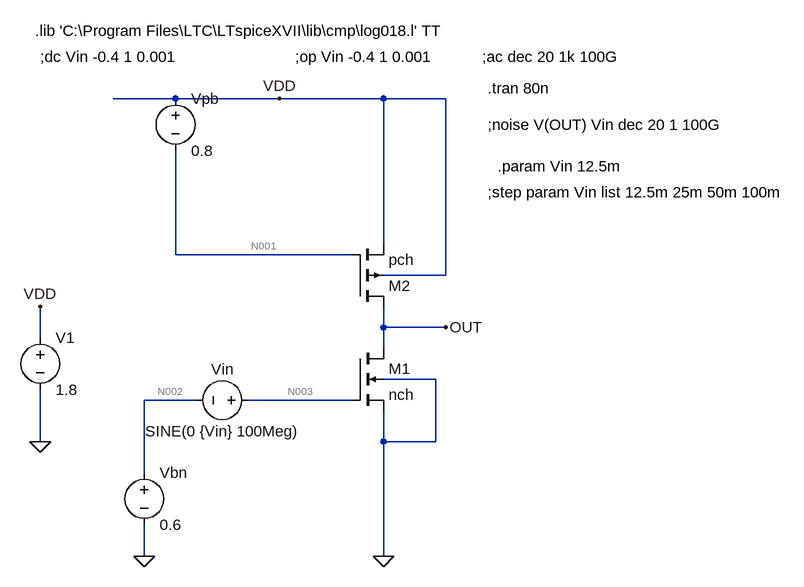
[diagram p0: schematic Draft1.asc]
Draft1.asc, the LTspice schematic file:
Version 4
SHEET 1 1212 884
WIRE 240 160 144 160
WIRE 400 160 240 160
WIRE 560 160 400 160
WIRE 656 160 560 160
WIRE 560 384 560 160
WIRE 240 400 240 240
WIRE 512 400 240 400
WIRE 656 432 656 160
WIRE 656 432 560 432
WIRE 560 512 560 480
WIRE 656 512 560 512
WIRE 32 528 32 480
WIRE 560 544 560 512
WIRE 640 592 560 592
WIRE 272 624 192 624
WIRE 512 624 352 624
WIRE 32 688 32 608
WIRE 560 688 560 640
WIRE 640 688 640 592
WIRE 640 688 560 688
WIRE 192 736 192 624
WIRE 192 864 192 816
WIRE 560 864 560 688
FLAG 32 688 0
FLAG 32 480 VDD
FLAG 192 864 0
FLAG 560 864 0
FLAG 656 512 OUT
FLAG 400 160 VDD
DATAFLAG 560 512 ""
SYMBOL nmos4 512 544 R0
SYMATTR InstName M1
SYMATTR Value nch
SYMATTR Value2 l=180n w=10u m=2
SYMBOL pmos4 512 480 M180
SYMATTR InstName M2
SYMATTR Value pch
SYMATTR Value2 l=180n w=10u m=2
SYMBOL voltage 32 512 R0
WINDOW 123 0 0 Left 0
WINDOW 39 0 0 Left 0
SYMATTR InstName V1
SYMATTR Value 1.8
SYMBOL voltage 240 144 R0
WINDOW 123 0 0 Left 0
WINDOW 39 0 0 Left 0
SYMATTR InstName Vpb
SYMATTR Value 0.8
SYMBOL voltage 368 624 R90
WINDOW 0 -32 56 VBottom 2
WINDOW 3 32 56 VTop 2
WINDOW 123 60 56 VTop 2
WINDOW 39 0 0 Left 0
SYMATTR InstName Vin
SYMATTR Value SINE(0 {Vin} 100Meg)
SYMBOL voltage 192 720 R0
WINDOW 123 0 0 Left 0
WINDOW 39 0 0 Left 0
SYMATTR InstName Vbn
SYMATTR Value 0.6
TEXT 24 56 Left 2 !.lib 'C:\\Program Files\\LTC\\LTspiceXVII\\lib\\cmp\\log018.l' TT
TEXT 32 96 Left 2 !;dc Vin -0.4 1 0.001
TEXT 424 96 Left 2 !;op Vin -0.4 1 0.001
TEXT 712 96 Left 2 !;ac dec 20 1k 100G
TEXT 720 144 Left 2 !.tran 80n
TEXT 720 200 Left 2 !;noise V(OUT) Vin dec 20 1 100G
TEXT 736 264 Left 2 !.param Vin 12.5m
TEXT 720 304 Left 2 !;step param Vin list 12.5m 25m 50m 100m

The netlist it stands for:
* Draft1.asc
M1 OUT N003 0 0 nch l=180n w=10u m=2
M2 OUT N001 VDD VDD pch l=180n w=10u m=2
V1 VDD 0 1.8
Vpb VDD N001 0.8
Vin N003 N002 SINE(0 {Vin} 100Meg)
Vbn N002 0 0.6
.model NMOS NMOS
.model PMOS PMOS
.lib standard.mos
.lib 'C:\Program Files\LTC\LTspiceXVII\lib\cmp\log018.l' TT
;dc Vin -0.4 1 0.001
;op Vin -0.4 1 0.001
;ac dec 20 1k 100G
.tran 80n
;noise V(OUT) Vin dec 20 1 100G
.param Vin 12.5m
;step param Vin list 12.5m 25m 50m 100m
.backanno
.end

* Results of the author's LTspice run, read from the files saved beside the schematic
* Operating Point, zero values left out:
*   V(out) = 1.181 V
*   V(n003) = 600 mV
*   V(n001) = 1 V
*   V(vdd) = 1.8 V
*   V(n002) = 600 mV
*   Id(M2) = -426.5 µA
*   Ib(M2) = 1.257 pA
*   Is(M2) = 426.5 µA
*   Id(M1) = 426.5 µA
*   Ib(M1) = -4.396 nA
*   Is(M1) = -426.5 µA
*   I(V1) = -426.5 µA
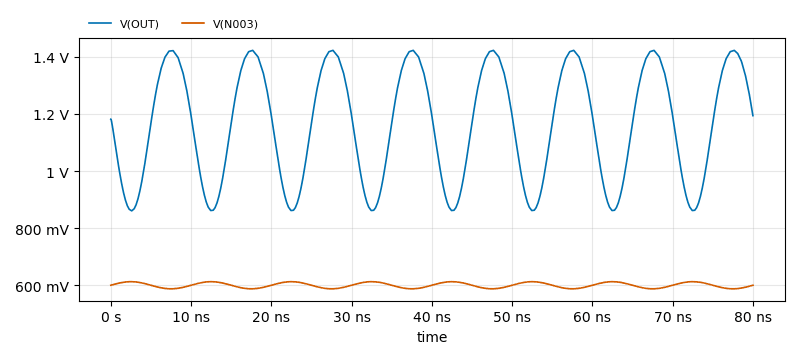
[diagram p1: Transient Analysis of Draft1.asc, plotted from the saved traces]
* Transient Analysis, 1 run:
*   V(OUT): min 860.5 mV, max 1.422 V, average 1.161 V, rms 1.178 V, last 1.194 V
*   V(N003): min 587.6 mV, max 612.5 mV, average 600 mV, rms 600.1 mV, last 600 mV